# EAGLE design blade-plate-10pin-drop (EAGLE 9.6.0)
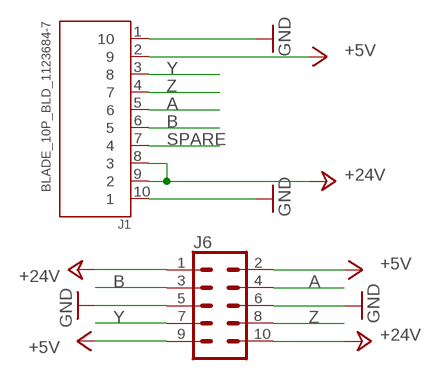
[diagram p0: schematic, sheet 1]

## Parts
J1  BLADE_10P_BLD_1123684-7  [TE_1123684-7]
J6  CONN_05X2SHD_LOCK_LATCH  [2X5-SHROUDED_LOCK_LATCH]

## Nets
+5V: J1.2 J6.2 J6.9
+24V: J1.8 J1.9 J6.1 J6.10
A: J1.5 J6.4
B: J1.6 J6.3
GND: J1.1 J1.10 J6.5 J6.6
SPARE: J1.7
Y: J1.3 J6.7
Z: J1.4 J6.8

## Library data of the parts
J1 = connector:BLADE_10P_BLD_1123684-7: 2.5 BATTERY CONN PLUG 10P STD Check prices <https://pricing.snapeda.com/parts/1123684-7/TE%20Connectivity/view-part?ref=eda>; AVAILABILITY: In Stock; COMMENT: 1123684-7; DESCRIPTION: Conn Battery PL 10 POS 2.5mm Solder RA Thru-Hole 10 Terminal 1 Port Tray; EU_ROHS_COMPLIANCE: Compliant; MF: TE Connectivity; MP: 1123684-7; PACKAGE: None; PRICE: None; PURCHASE-URL: https://pricing.snapeda.com/search/part/1123684-7/?ref=eda
J6 = SparkFun-Connectors:CONN_05X2: Multi connection point. Often used as Generic Header-pin footprint for 0.1 inch spaced/style header connections For AVR SPI programming port, see special device with nice symbol: "AVR_SPI_PROG_5x2.dev" You can populate with any combo of single row headers, but if you'd like an exact match, check these: 2x5 AVR ICSP Male Header <https://www.sparkfun.com/products/778> (PRT-00778) 2x5 Pin Shrouded Header <https://www.sparkfun.com/products/8506> (PRT-08506) On any of the 0.1 inch spaced packages, you can populate with these: Break Away Headers - Straight <https://www.sparkfun.com/products/116> (PRT-00116) Break Away Male Headers - Right Angle <https://www.sparkfun.com/products/553> (PRT-00553) Female Headers <https://www.sparkfun.com/products/115> (PRT-00115) Break Away Headers - Machine Pin <https://www.sparkfun.com/products/117> (PRT-00117) Break Away Female Headers - Swiss Machine Pin <https://www.sparkfun.com/products/743> (PRT-00743) Special note: the shrouded connector mates well with our 5x2 ribbon cables: 2x5 Pin IDC Ribbon Cable <https://www.sparkfun.com/products/8535> (PRT-08535)

## Board
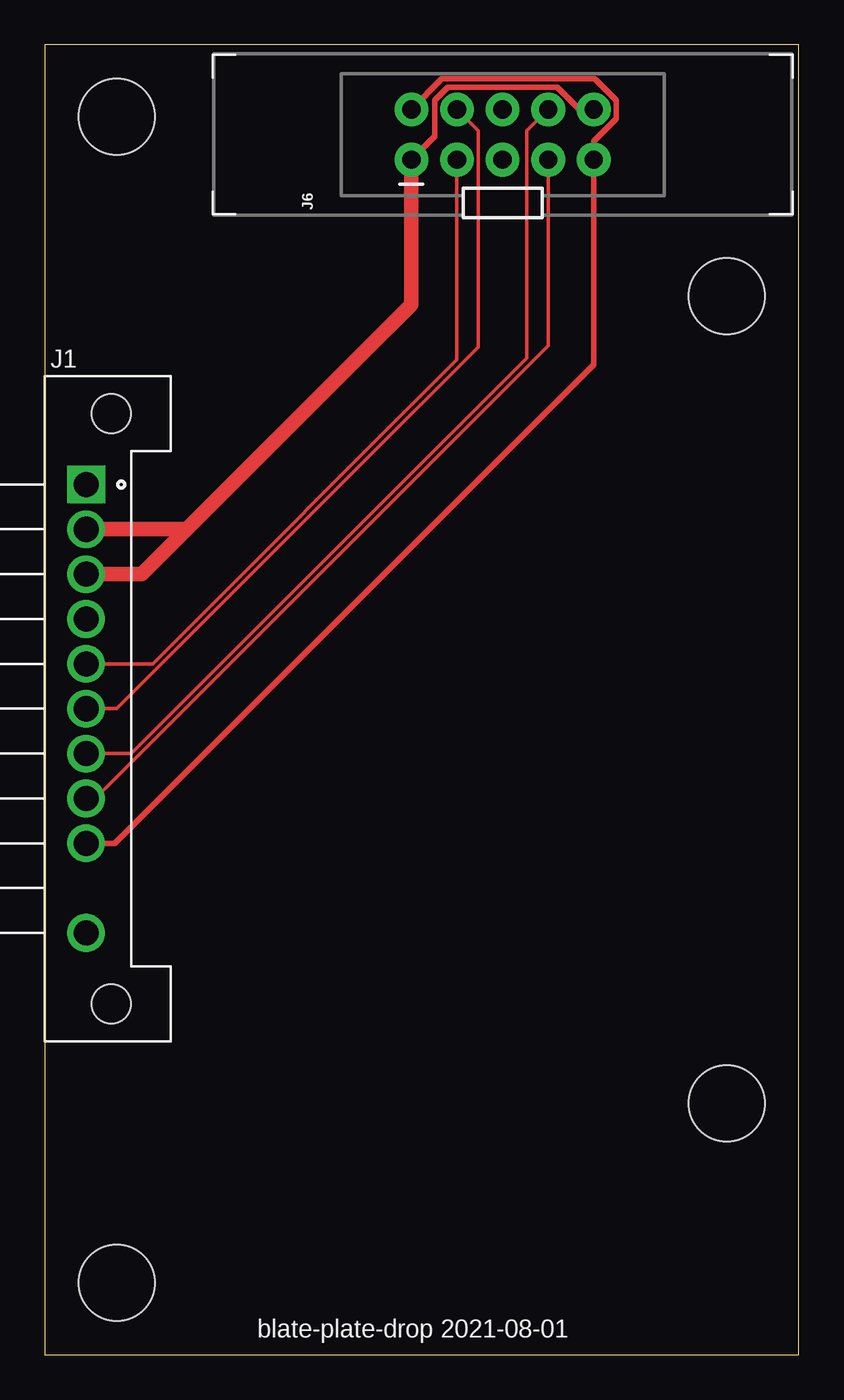
[diagram p1: board, top side]
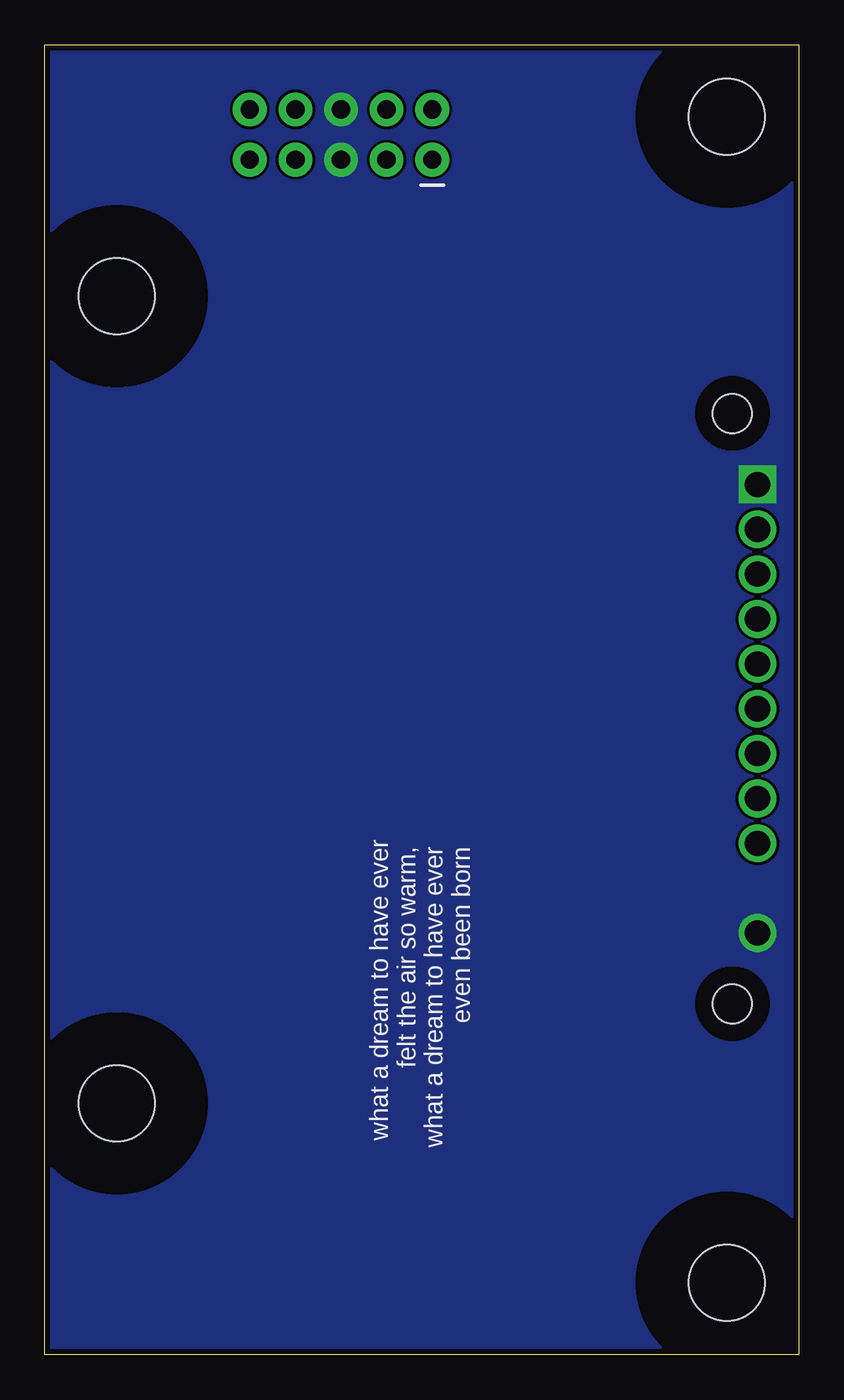
[diagram p2: board, bottom side, seen from below]

Size 42 x 73 mm. Coordinates in mm from the lower left corner, seen from the top.
Outline: 0,0 42,0 42,73 0,73 0,0
Copper layers (1*16): Top 0.035mm / dielectric 1.5mm / Bottom 0.035mm
Design rules "default *": minimum track width 6mil, minimum drill 0.35mm, track to track 6mil, track to pad 6mil, pad to pad 6mil, via to via 6mil, smd to smd 6mil, copper to edge 12mil, drill to drill 6mil, minimum pad ring 10mil, minimum via ring 8mil, stop-mask expansion 4mil, vias tented up to drill 35mil, thermal gap 10mil
Holes 4.25 mm at 4,69 4,4 38,14 38,59
bRestrict: area 1.7,50.5 to 5.7,54.5; area 1.7,17.6 to 5.7,21.6; area 33,9 to 43,19; area -1,-1 to 9,9; area 33,54 to 43,64; area -1,64 to 9,74

### Footprints (pad centres in the part's own frame; a part is rotated, then mirrored left to right if it is on the bottom)
TE_1123684-7 = drill 1.4: 1 12.5,0; 2 7.5,0; 3 5,0; 4 2.5,0; 5 0,0; 6 -2.5,0; 7 -5,0; 8 -7.5,0; 9 -10,0 | drill 1.4 square: 10 -12.5,0 | hole 2.2: -16.45,1.4; 16.45,1.4
2X5-SHROUDED_LOCK_LATCH = drill 1.016 pad 1.88: 1 -1.397,5.08; 2 1.397,5.08; 3 -1.397,2.54; 4 1.397,2.54; 5 -1.397,0; 6 1.397,0; 7 -1.397,-2.54; 8 1.397,-2.54; 9 -1.397,-5.08; 10 1.397,-5.08

### Placement (x,y rotation side)
J1  2.3,36 270 top
J6  25.5,68 90 top

### Tracks (layer width: path | path; a pad name or v marks a point on that pad's centre or on a via)
+5V
  Top 0.305: J6.2 22.12,71.1 30.64,71.1 31.82,69.91 31.82,68.88 30.58,67.64 J6.9 30.58,55.18 3.9,28.5 J1.2
+24V
  Top 0.305: J6.10 29.8,69.4 28.56,70.64 22.44,70.64 21.71,69.91 21.71,67.9 J6.1
  Top 0.813: J1.9 7.9,46 | J6.1 20.42,58.52 7.9,46 | J1.8 5.4,43.5 7.9,46
A
  Top 0.203: J1.5 4,36 24.15,56.15 24.15,68.2 J6.4
B
  Top 0.203: J1.6 6,38.5 22.96,55.46 J6.3
GND
  pour Bottom (no thermals): -1,74 42,74 42,-1 -1,-1
Y
  Top 0.203: J1.3 2.8,31 28.04,56.24 J6.7
Z
  Top 0.203: J1.4 4.8,33.5 26.85,55.55 26.85,68.2 J6.8

### Text on the board
tPlace: blate-plate-drop 2021-08-01
bPlace: what a dream to have ever / felt the air so warm, / what a dream to have ever / even been born